# EAGLE design 150218_AriloRX_REV2_0_0 (EAGLE 6.4)
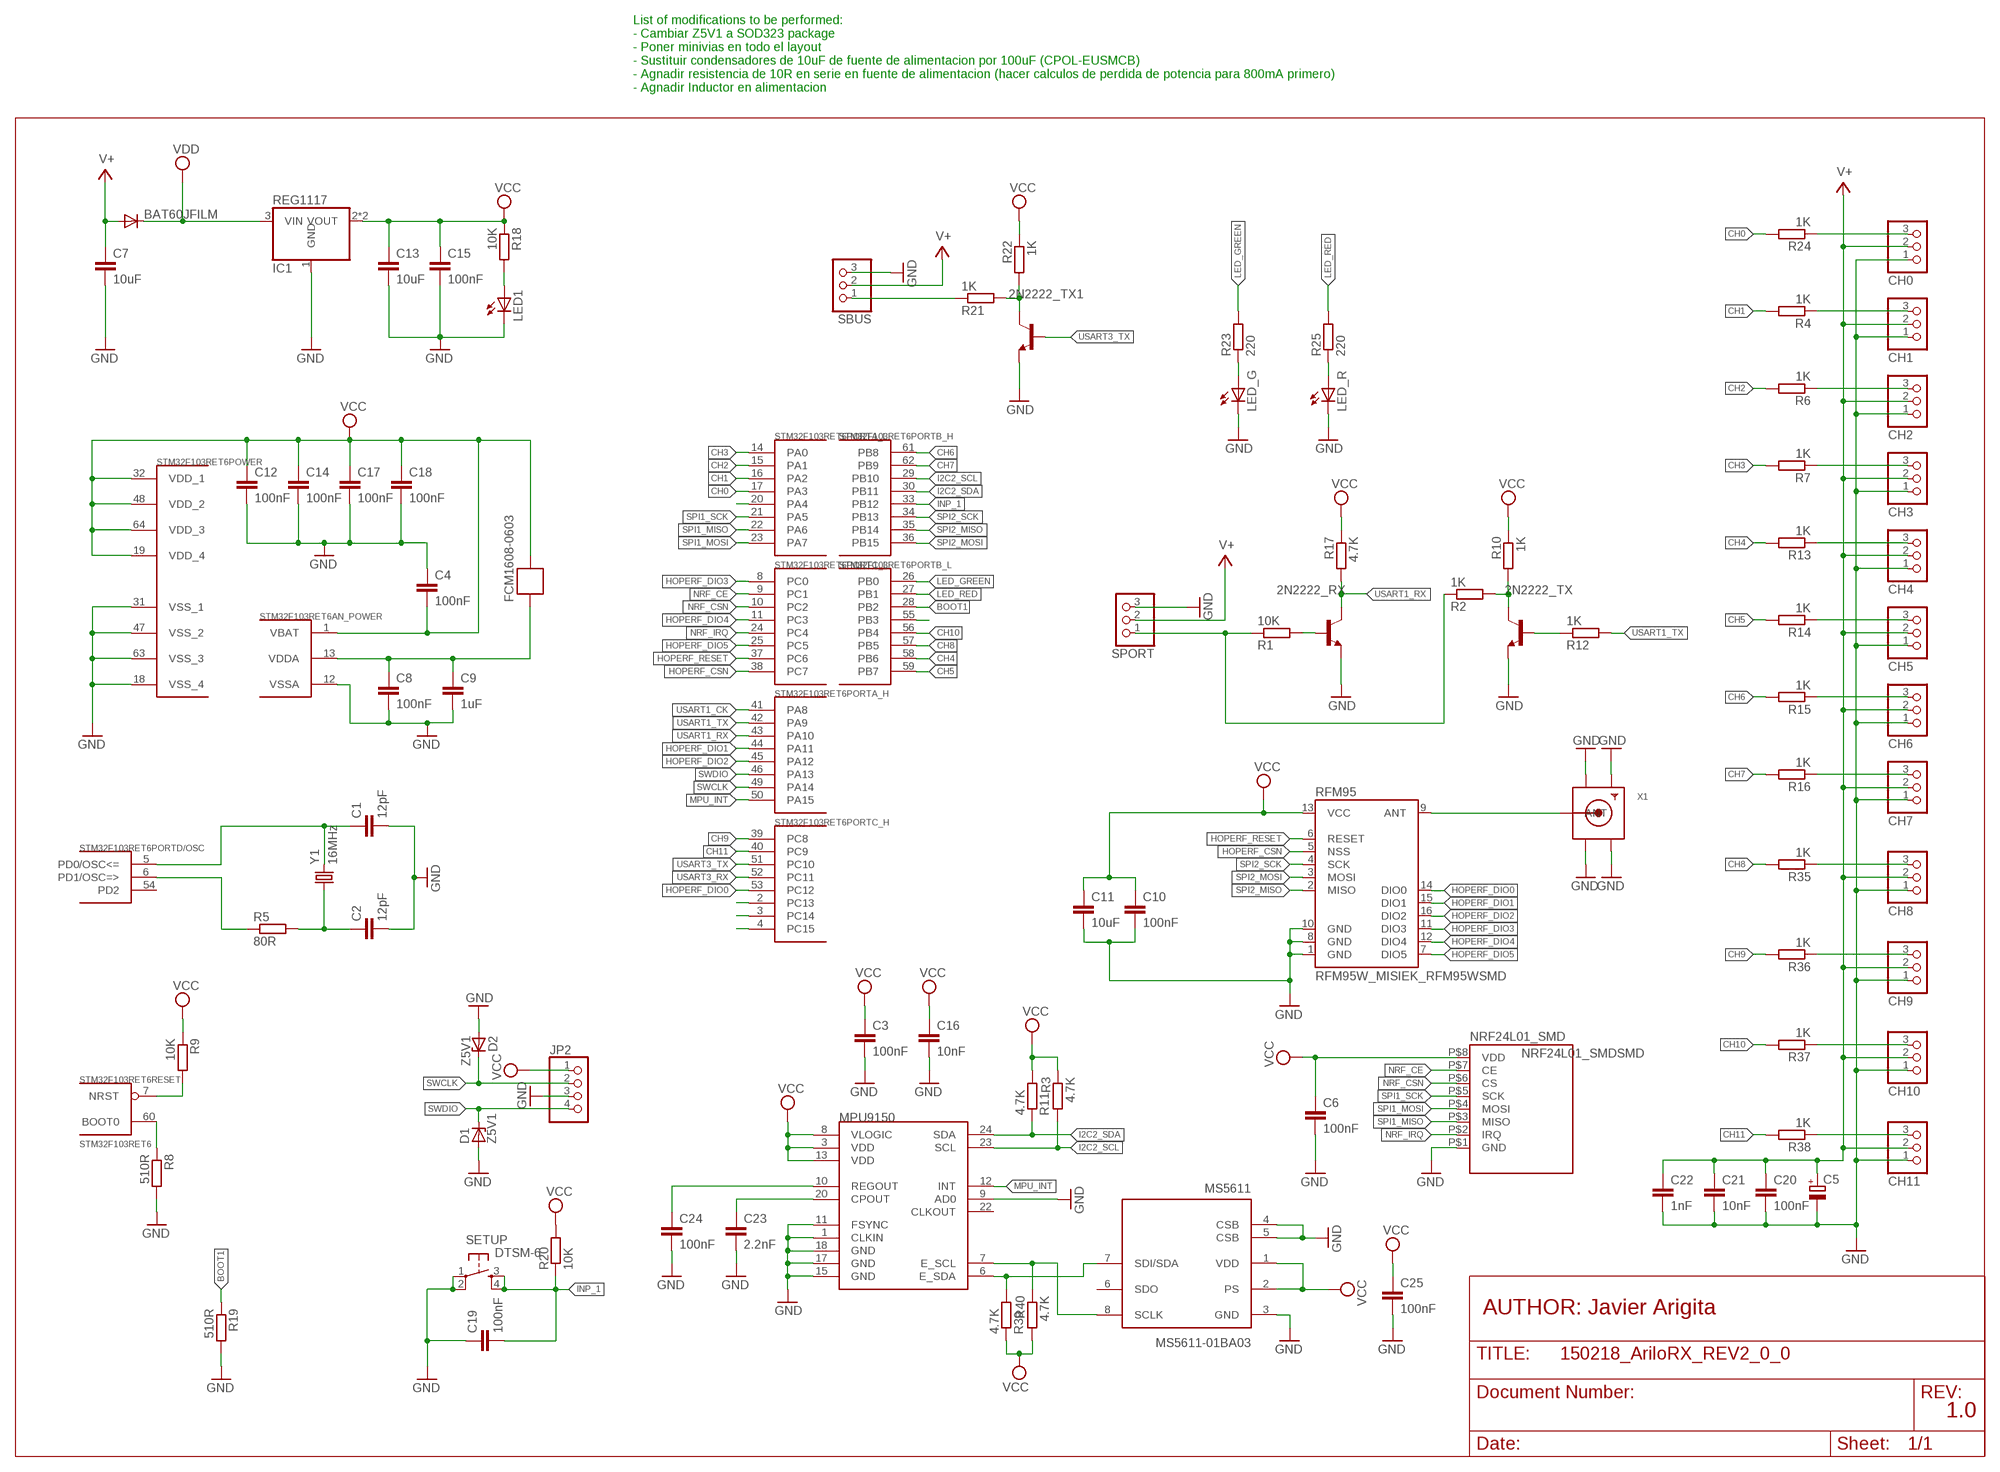
[diagram p0: schematic, sheet 1]

## Parts
2N2222_RX  MMBT2222ALT1-NPN-SOT23-BEC  [SOT23-BEC]
2N2222_TX  MMBT2222ALT1-NPN-SOT23-BEC  [SOT23-BEC]
2N2222_TX1  MMBT2222ALT1-NPN-SOT23-BEC  [SOT23-BEC]
BAT60JFILM  DIODE-SOD323-R  [SOD323-R]
C1  12pF  RESISTOR_C-EUC0603  [RESISTOR_C0603]
C2  12pF  RESISTOR_C-EUC0603  [RESISTOR_C0603]
C3  100nF  RESISTOR_C-EUC0603  [RESISTOR_C0603]
C4  100nF  RESISTOR_C-EUC0603  [RESISTOR_C0603]
C5  CPOL-EUSMCB  [SMC_B]
C6  100nF  RESISTOR_C-EUC0603  [RESISTOR_C0603]
C7  10uF  RESISTOR_C-EUC3216  [RESISTOR_C3216]
C8  100nF  RESISTOR_C-EUC0603  [RESISTOR_C0603]
C9  1uF  RESISTOR_C-EUC0603  [RESISTOR_C0603]
C10  100nF  RESISTOR_C-EUC0603  [RESISTOR_C0603]
C11  10uF  RESISTOR_C-EUC3216  [RESISTOR_C3216]
C12  100nF  RESISTOR_C-EUC0603  [RESISTOR_C0603]
C13  10uF  RESISTOR_C-EUC3216  [RESISTOR_C3216]
C14  100nF  RESISTOR_C-EUC0603  [RESISTOR_C0603]
C15  100nF  RESISTOR_C-EUC0603  [RESISTOR_C0603]
C16  10nF  RESISTOR_C-EUC0603  [RESISTOR_C0603]
C17  100nF  RESISTOR_C-EUC0603  [RESISTOR_C0603]
C18  100nF  RESISTOR_C-EUC0603  [RESISTOR_C0603]
C19  100nF  RESISTOR_C-EUC0603  [RESISTOR_C0603]
C20  100nF  RESISTOR_C-EUC0603  [RESISTOR_C0603]
C21  10nF  RESISTOR_C-EUC0603  [RESISTOR_C0603]
C22  1nF  RESISTOR_C-EUC0603  [RESISTOR_C0603]
C23  2.2nF  RESISTOR_C-EUC0603  [RESISTOR_C0603]
C24  100nF  RESISTOR_C-EUC0603  [RESISTOR_C0603]
C25  100nF  RESISTOR_C-EUC0603  [RESISTOR_C0603]
CH0  PINHD-1X3  [1X03]
CH1  PINHD-1X3  [1X03]
CH2  PINHD-1X3  [1X03]
CH3  PINHD-1X3  [1X03]
CH4  PINHD-1X3  [1X03]
CH5  PINHD-1X3  [1X03]
CH6  PINHD-1X3  [1X03]
CH7  PINHD-1X3  [1X03]
CH8  PINHD-1X3  [1X03]
CH9  PINHD-1X3  [1X03]
CH10  PINHD-1X3  [1X03]
CH11  PINHD-1X3  [1X03]
D1  Z5V1  ZENER-DIODESOD80C  [SOD80C]
D2  Z5V1  ZENER-DIODESOD80C  [SOD80C]
FCM1608-0603  FERRITE-BEAD  [R0603]
IC1  REG1117  [SOT223]
JP2  PINHD-1X4  [1X04]
LED1  LED_LEDCHIP-LED0603  [LED_CHIP-LED0603]
LED_G  LEDCHIP-LED0603  [CHIP-LED0603]
LED_R  LEDCHIP-LED0603  [CHIP-LED0603]
MPU9150  MPU-9150QFN-24-NP  [QFN-24-NP]
MS5611  MS5611-01BA03  [SON125P300X500X100-8N]
NRF24L01_SMD  NRF24L01_SMDSMD  [NRF24L01_SMD]
R1  10K  RCL_R-EU_R0603  [RCL_R0603]
R2  1K  RCL_R-EU_R0603  [RCL_R0603]
R3  4.7K  RCL_R-EU_R0603  [RCL_R0603]
R4  1K  RCL_R-EU_R0603  [RCL_R0603]
R5  80R  RCL_R-EU_R0603  [RCL_R0603]
R6  1K  RCL_R-EU_R0603  [RCL_R0603]
R7  1K  RCL_R-EU_R0603  [RCL_R0603]
R8  510R  RCL_R-EU_R0603  [RCL_R0603]
R9  10K  RCL_R-EU_R0603  [RCL_R0603]
R10  1K  RCL_R-EU_R0603  [RCL_R0603]
R11  4.7K  RCL_R-EU_R0603  [RCL_R0603]
R12  1K  RCL_R-EU_R0603  [RCL_R0603]
R13  1K  RCL_R-EU_R0603  [RCL_R0603]
R14  1K  RCL_R-EU_R0603  [RCL_R0603]
R15  1K  RCL_R-EU_R0603  [RCL_R0603]
R16  1K  RCL_R-EU_R0603  [RCL_R0603]
R17  4.7K  RCL_R-EU_R0603  [RCL_R0603]
R18  10K  RCL_R-EU_R0603  [RCL_R0603]
R19  510R  RCL_R-EU_R0603  [RCL_R0603]
R20  10K  RCL_R-EU_R0603  [RCL_R0603]
R21  1K  RCL_R-EU_R0603  [RCL_R0603]
R22  1K  RCL_R-EU_R0603  [RCL_R0603]
R23  220  RCL_R-EU_R0603  [RCL_R0603]
R24  1K  RCL_R-EU_R0603  [RCL_R0603]
R25  220  RCL_R-EU_R0603  [RCL_R0603]
R35  1K  RCL_R-EU_R0603  [RCL_R0603]
R36  1K  RCL_R-EU_R0603  [RCL_R0603]
R37  1K  RCL_R-EU_R0603  [RCL_R0603]
R38  1K  RCL_R-EU_R0603  [RCL_R0603]
R39  4.7K  RCL_R-EU_R0603  [RCL_R0603]
R40  4.7K  RCL_R-EU_R0603  [RCL_R0603]
RFM95  RFM95W_MISIEK_RFM95WSMD  [RFM95W_MISIEK_RFM95W_SMD]
SBUS  PINHD-1X3  [1X03]
SETUP  DTSM-6  [DTSM-6]
SPORT  PINHD-1X3  [1X03]
STM32F103RET6  STM32F103RET6  STM32F10XRXT6  [TQFP64]
X1  SMACONNECTOR_EDGE  [SMA_EDGELAUNCH]
Y1  16MHz  CRYSTAL5X3  [CRYSTAL-SMD-5X3]

## Nets
BOOT1: R19.1 STM32F103RET6.28(PORTB_L:PB2)
CH0: R24.2 STM32F103RET6.17(PORTA_L:PA3)
CH1: R4.2 STM32F103RET6.16(PORTA_L:PA2)
CH2: R6.2 STM32F103RET6.15(PORTA_L:PA1)
CH3: R7.2 STM32F103RET6.14(PORTA_L:PA0)
CH4: R13.2 STM32F103RET6.58(PORTB_L:PB6)
CH5: R14.2 STM32F103RET6.59(PORTB_L:PB7)
CH6: R15.2 STM32F103RET6.61(PORTB_H:PB8)
CH7: R16.2 STM32F103RET6.62(PORTB_H:PB9)
CH8: R35.2 STM32F103RET6.57(PORTB_L:PB5)
CH9: R36.2 STM32F103RET6.39(PORTC_H:PC8)
CH10: R37.2 STM32F103RET6.56(PORTB_L:PB4)
CH11: R38.2 STM32F103RET6.40(PORTC_H:PC9)
GND: 2N2222_RX.E 2N2222_TX1.E 2N2222_TX.E C1.2 C2.2 C3.2 C4.1 C5.- C6.2 C7.2 C8.2 C9.2 C10.2 C11.2 C12.2 C13.2 C14.2 C15.2 C16.2 C17.2 C18.2 C19.1 C20.2 C21.2 C22.2 C23.2 C24.2 C25.2 CH0.1 CH1.1 CH2.1 CH3.1 CH4.1 CH5.1 CH6.1 CH7.1 CH8.1 CH9.1 CH10.1 CH11.1 D1.A D2.A IC1.1(GND) JP2.3 LED1.C LED_G.C LED_R.C MPU9150.1(CLKIN) MPU9150.9(AD0) MPU9150.11(FSYNC) MPU9150.15(GND) MPU9150.17(GND) MPU9150.18(GND) MS5611.3(GND) MS5611.4(CSB) MS5611.5(CSB) NRF24L01_SMD.P$1(GND) R8.2 R19.2 RFM95.1(GND) RFM95.8(GND) RFM95.10(GND) SBUS.3 SETUP.1 SETUP.2 SPORT.3 STM32F103RET6.12(AN_POWER:VSSA) STM32F103RET6.18(POWER:VSS_4) STM32F103RET6.31(POWER:VSS_1) STM32F103RET6.47(POWER:VSS_2) STM32F103RET6.63(POWER:VSS_3) X1.GND@1(GND4) X1.GND@2(GND3) X1.GND@3(GND2) X1.GND@4(GND1)
HOPERF_CSN: RFM95.5(NSS) STM32F103RET6.38(PORTC_L:PC7)
HOPERF_DIO0: RFM95.14(DIO0) STM32F103RET6.53(PORTC_H:PC12)
HOPERF_DIO1: RFM95.15(DIO1) STM32F103RET6.44(PORTA_H:PA11)
HOPERF_DIO2: RFM95.16(DIO2) STM32F103RET6.45(PORTA_H:PA12)
HOPERF_DIO3: RFM95.11(DIO3) STM32F103RET6.8(PORTC_L:PC0)
HOPERF_DIO4: RFM95.12(DIO4) STM32F103RET6.11(PORTC_L:PC3)
HOPERF_DIO5: RFM95.7(DIO5) STM32F103RET6.25(PORTC_L:PC5)
HOPERF_RESET: RFM95.6(RESET) STM32F103RET6.37(PORTC_L:PC6)
I2C2_SCL: MPU9150.23(SCL) R3.2 STM32F103RET6.29(PORTB_H:PB10)
I2C2_SDA: MPU9150.24(SDA) R11.1 STM32F103RET6.30(PORTB_H:PB11)
INP_1: C19.2 R20.1 SETUP.3 SETUP.4 STM32F103RET6.33(PORTB_H:PB12)
LED_GREEN: R23.2 STM32F103RET6.26(PORTB_L:PB0)
LED_RED: R25.2 STM32F103RET6.27(PORTB_L:PB1)
MPU_INT: MPU9150.12(INT) STM32F103RET6.50(PORTA_H:PA15)
N$1: C1.1 STM32F103RET6.5(PORTD/OSC:PD0/OSC<=) Y1.3
N$2: R5.1 STM32F103RET6.6(PORTD/OSC:PD1/OSC=>)
N$3: C2.1 R5.2 Y1.1
N$4: R8.1 STM32F103RET6.60(RESET:BOOT0)
N$5: 2N2222_TX.C R2.2 R10.2
N$6: STM32F103RET6.20(PORTA_L:PA4)
N$7: RFM95.9(ANT) X1.P(ANT)
N$8: 2N2222_TX.B R12.1
N$9: CH0.3 R24.1
N$10: LED1.A R18.2
N$11: 2N2222_TX1.C R21.2 R22.2
N$12: LED_G.A R23.1
N$13: CH8.3 R35.1
N$14: R1.1 R2.1 SPORT.1
N$15: LED_R.A R25.1
N$16: 2N2222_RX.B R1.2
N$17: C8.1 C9.1 FCM1608-0603.2 STM32F103RET6.13(AN_POWER:VDDA)
N$20: STM32F103RET6.2(PORTC_H:PC13)
N$21: CH2.3 R6.1
N$22: STM32F103RET6.3(PORTC_H:PC14)
N$23: CH4.3 R13.1
N$24: STM32F103RET6.4(PORTC_H:PC15)
N$25: CH9.3 R36.1
N$26: CH10.3 R37.1
N$27: CH11.3 R38.1
N$28: MPU9150.7(E_SCL) MS5611.8(SCLK) R40.1
N$29: MPU9150.6(E_SDA) MS5611.7(SDI/SDA) R39.2
N$30: STM32F103RET6.55(PORTB_L:PB3)
N$31: CH3.3 R7.1
N$32: CH6.3 R15.1
N$33: C23.1 MPU9150.20(CPOUT)
N$34: CH5.3 R14.1
N$35: CH7.3 R16.1
N$40: C24.1 MPU9150.10(REGOUT)
N$53: CH1.3 R4.1
NRF_CE: NRF24L01_SMD.P$7(CE) STM32F103RET6.9(PORTC_L:PC1)
NRF_CSN: NRF24L01_SMD.P$6(CS) STM32F103RET6.10(PORTC_L:PC2)
NRF_IRQ: NRF24L01_SMD.P$2(IRQ) STM32F103RET6.24(PORTC_L:PC4)
NSRST: R9.2 STM32F103RET6.7(RESET:NRST)
SBUS: R21.1 SBUS.1
SPI1_MISO: NRF24L01_SMD.P$3(MISO) STM32F103RET6.22(PORTA_L:PA6)
SPI1_MOSI: NRF24L01_SMD.P$4(MOSI) STM32F103RET6.23(PORTA_L:PA7)
SPI1_SCK: NRF24L01_SMD.P$5(SCK) STM32F103RET6.21(PORTA_L:PA5)
SPI2_MISO: RFM95.2(MISO) STM32F103RET6.35(PORTB_H:PB14)
SPI2_MOSI: RFM95.3(MOSI) STM32F103RET6.36(PORTB_H:PB15)
SPI2_SCK: RFM95.4(SCK) STM32F103RET6.34(PORTB_H:PB13)
SWCLK: D2.C JP2.2 STM32F103RET6.49(PORTA_H:PA14)
SWDIO: D1.C JP2.4 STM32F103RET6.46(PORTA_H:PA13)
USART1_CK: STM32F103RET6.41(PORTA_H:PA8)
USART1_RX: 2N2222_RX.C R17.2 STM32F103RET6.43(PORTA_H:PA10)
USART1_TX: R12.2 STM32F103RET6.42(PORTA_H:PA9)
USART3_RX: STM32F103RET6.52(PORTC_H:PC11)
USART3_TX: 2N2222_TX1.B STM32F103RET6.51(PORTC_H:PC10)
V+: BAT60JFILM.A C5.+ C7.1 C20.1 C21.1 C22.1 CH0.2 CH1.2 CH2.2 CH3.2 CH4.2 CH5.2 CH6.2 CH7.2 CH8.2 CH9.2 CH10.2 CH11.2 SBUS.2 SPORT.2
VCC: C3.1 C4.2 C6.1 C10.1 C11.1 C12.1 C13.1 C14.1 C15.1 C16.1 C17.1 C18.1 C25.1 FCM1608-0603.1 IC1.2(VOUT) IC1.4(VOUT) JP2.1 MPU9150.3(VDD) MPU9150.8(VLOGIC) MPU9150.13(VDD) MS5611.1(VDD) MS5611.2(PS) NRF24L01_SMD.P$8(VDD) R3.1 R9.1 R10.1 R11.2 R17.1 R18.1 R20.2 R22.1 R39.1 R40.2 RFM95.13(VCC) STM32F103RET6.1(AN_POWER:VBAT) STM32F103RET6.19(POWER:VDD_4) STM32F103RET6.32(POWER:VDD_1) STM32F103RET6.48(POWER:VDD_2) STM32F103RET6.64(POWER:VDD_3)
VDD: BAT60JFILM.C IC1.3(VIN)
Unconnected: MPU9150.22(CLKOUT) MS5611.6(SDO) STM32F103RET6.54(PORTD/OSC:PD2)

## Notes on the sheet
- List of modifications to be performed:
  - Cambiar Z5V1 a SOD323 package
  - Poner minivias en todo el layout
  - Sustituir condensadores de 10uF de fuente de alimentacion por 100uF (CPOL-EUSMCB)
  - Agnadir resistencia de 10R en serie en fuente de alimentacion (hacer calculos de perdida de potencia para 800mA primero)
  - Agnadir Inductor en alimentacion
- AUTHOR: Javier Arigita
- 1.0

## Library data of the parts
2N2222_RX 2N2222_TX 2N2222_TX1 = transistor:*-NPN-: NPN Transistror BF959 corrected 2008.03.06
BAT60JFILM = diode:DIODE-: DIODE
C1-C4 C6-C25 = AriloTX:RESISTOR_C-EU: CAPACITOR, European symbol
C5 = rcl:CPOL-EU: POLARIZED CAPACITOR, European symbol
CH0 CH1-CH11 = pinhead_rc:PINHD-1X3: PIN HEADER
D1 D2 = diode:ZENER-DIODE: Z-Diode
FCM1608-0603 = BaseApp:FERRITE-BEAD
IC1 = CEDT:REG1117: 800mA and 1A Low Dropout (LDO) Positive Regulator 1.8V, 2.5V, 2.85V, 3.3V, 5V, and Adj
JP2 = pinhead:PINHD-1X4: PIN HEADER
LED1 = AriloTX:LED_LED: LED OSRAM: - CHIPLED LG R971, LG N971, LY N971, LG Q971, LY Q971, LO R971, LY R971 LH N974, LH R974 LS Q976, LO Q976, LY Q976 LO Q996 - Hyper CHIPLED LW Q18S LB Q993, LB Q99A, LB R99A - SideLED LS A670, LO A670, LY A670, LG A670, LP A670 LB A673, LV A673, LT A673, LW A673 LH A674 LY A675 LS A676, LA A676, LO A676, LY A676, LW A676 LS A679, LY A679, LG A679 - Hyper Micro SIDELED® LS Y876, LA Y876, LO Y876, LY Y876 LT Y87S - SmartLED LW L88C, LW L88S LB L89C, LB L89S, LG L890 LS L89K, LO L89K, LY L89K LS L896, LA L896, LO L896, LY L896 - TOPLED LS T670, LO T670, LY T670, LG T670, LP T670 LSG T670, LSP T670, LSY T670, LOP T670, LYG T670 LG T671, LOG T671, LSG T671 LB T673, LV T673, LT T673, LW T673 LH T674 LS T676, LA T676, LO T676, LY T676, LB T676, LH T676, LSB T676, LW T676 LB T67C, LV T67C, LT T67C, LS T67K, LO T67K, LY T67K, LW E67C LS E67B, LA E67B, LO E67B, LY E67B, LB E67C, LV E67C, LT E67C LW T67C LS T679, LY T679, LG T679 LS T770, LO T770, LY T770, LG T770, LP T770 LB T773, LV T773, LT T773, LW T773 LH T774 LS E675, LA E675, LY E675, LS T675 LS T776, LA T776, LO T776, LY T776, LB T776 LHGB T686 LT T68C, LB T68C - Hyper Mini TOPLED® LB M676 - Mini TOPLED Santana® LG M470 LS M47K, LO M47K, LY M47K Source: http://www.osram.convergy.de LUXEON: - LUMILED® LXK2-PW12-R00, LXK2-PW12-S00, LXK2-PW14-U00, LXK2-PW14-V00 LXK2-PM12-R00, LXK2-PM12-S00, LXK2-PM14-U00 LXK2-PE12-Q00, LXK2-PE12-R00, LXK2-PE12-S00, LXK2-PE14-T00, LXK2-PE14-U00 LXK2-PB12-K00, LXK2-PB12-L00, LXK2-PB12-M00, LXK2-PB14-N00, LXK2-PB14-P00, LXK2-PB14-Q00 LXK2-PR12-L00, LXK2-PR12-M00, LXK2-PR14-Q00, LXK2-PR14-R00 LXK2-PD12-Q00, LXK2-PD12-R00, LXK2-PD12-S00 LXK2-PH12-R00, LXK2-PH12-S00 LXK2-PL12-P00, LXK2-PL12-Q00, LXK2-PL12-R00 Source: www.luxeon.com KINGBRIGHT: KA-3528ASYC Source: www.kingbright.com
LED_G LED_R = led:LED: LED OSRAM: - CHIPLED LG R971, LG N971, LY N971, LG Q971, LY Q971, LO R971, LY R971 LH N974, LH R974 LS Q976, LO Q976, LY Q976 LO Q996 - Hyper CHIPLED LW Q18S LB Q993, LB Q99A, LB R99A - SideLED LS A670, LO A670, LY A670, LG A670, LP A670 LB A673, LV A673, LT A673, LW A673 LH A674 LY A675 LS A676, LA A676, LO A676, LY A676, LW A676 LS A679, LY A679, LG A679 - Hyper Micro SIDELED® LS Y876, LA Y876, LO Y876, LY Y876 LT Y87S - SmartLED LW L88C, LW L88S LB L89C, LB L89S, LG L890 LS L89K, LO L89K, LY L89K LS L896, LA L896, LO L896, LY L896 - TOPLED LS T670, LO T670, LY T670, LG T670, LP T670 LSG T670, LSP T670, LSY T670, LOP T670, LYG T670 LG T671, LOG T671, LSG T671 LB T673, LV T673, LT T673, LW T673 LH T674 LS T676, LA T676, LO T676, LY T676, LB T676, LH T676, LSB T676, LW T676 LB T67C, LV T67C, LT T67C, LS T67K, LO T67K, LY T67K, LW E67C LS E67B, LA E67B, LO E67B, LY E67B, LB E67C, LV E67C, LT E67C LW T67C LS T679, LY T679, LG T679 LS T770, LO T770, LY T770, LG T770, LP T770 LB T773, LV T773, LT T773, LW T773 LH T774 LS E675, LA E675, LY E675, LS T675 LS T776, LA T776, LO T776, LY T776, LB T776 LHGB T686 LT T68C, LB T68C - Hyper Mini TOPLED® LB M676 - Mini TOPLED Santana® LG M470 LS M47K, LO M47K, LY M47K Source: http://www.osram.convergy.de LUXEON: - LUMILED® LXK2-PW12-R00, LXK2-PW12-S00, LXK2-PW14-U00, LXK2-PW14-V00 LXK2-PM12-R00, LXK2-PM12-S00, LXK2-PM14-U00 LXK2-PE12-Q00, LXK2-PE12-R00, LXK2-PE12-S00, LXK2-PE14-T00, LXK2-PE14-U00 LXK2-PB12-K00, LXK2-PB12-L00, LXK2-PB12-M00, LXK2-PB14-N00, LXK2-PB14-P00, LXK2-PB14-Q00 LXK2-PR12-L00, LXK2-PR12-M00, LXK2-PR14-Q00, LXK2-PR14-R00 LXK2-PD12-Q00, LXK2-PD12-R00, LXK2-PD12-S00 LXK2-PH12-R00, LXK2-PH12-S00 LXK2-PL12-P00, LXK2-PL12-Q00, LXK2-PL12-R00 Source: www.luxeon.com KINGBRIGHT: KA-3528ASYC Source: www.kingbright.com
MPU9150 = SparkFun-Sensors:MPU-9150: 9DOF (3mag, 3accel, 3rotat). I2C interface.
MS5611 = Measurement-Specialties:MS5611-01BA03: Variometer Module, with stainless steel cap
NRF24L01_SMD = NRF24L01+:NRF24L01_SMD
R1-R25 R35-R40 = AriloTX:RCL_R-EU_: RESISTOR, European symbol
RFM95 = AriloTX:RFM95W_MISIEK_RFM95W
SBUS SPORT = pinhead:PINHD-1X3: PIN HEADER
SETUP = switch-tact:DTSM-6
STM32F103RET6 = stm32:STM32F10XRXT6: STM32F101/103 64pin LQFP
X1 = adafruit:SMACONNECTOR: SMA Connector 90° DIP SMA Connector, 50 Ohm (4UConnector: 07259)
Y1 = SparkFun-FreqCtrl:CRYSTAL: Various standard crystals. Proven footprints. Spark Fun Electronics SKU : COM-00534

## Board
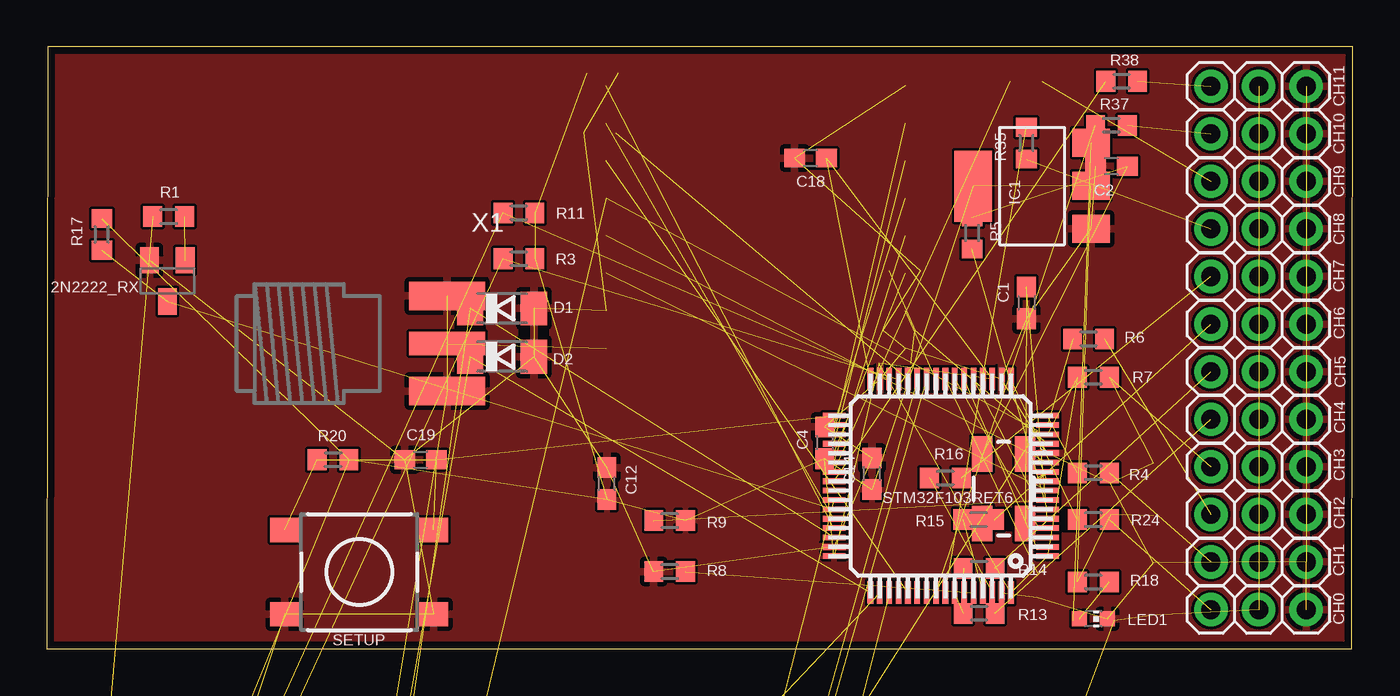
[diagram p1: board, top side]
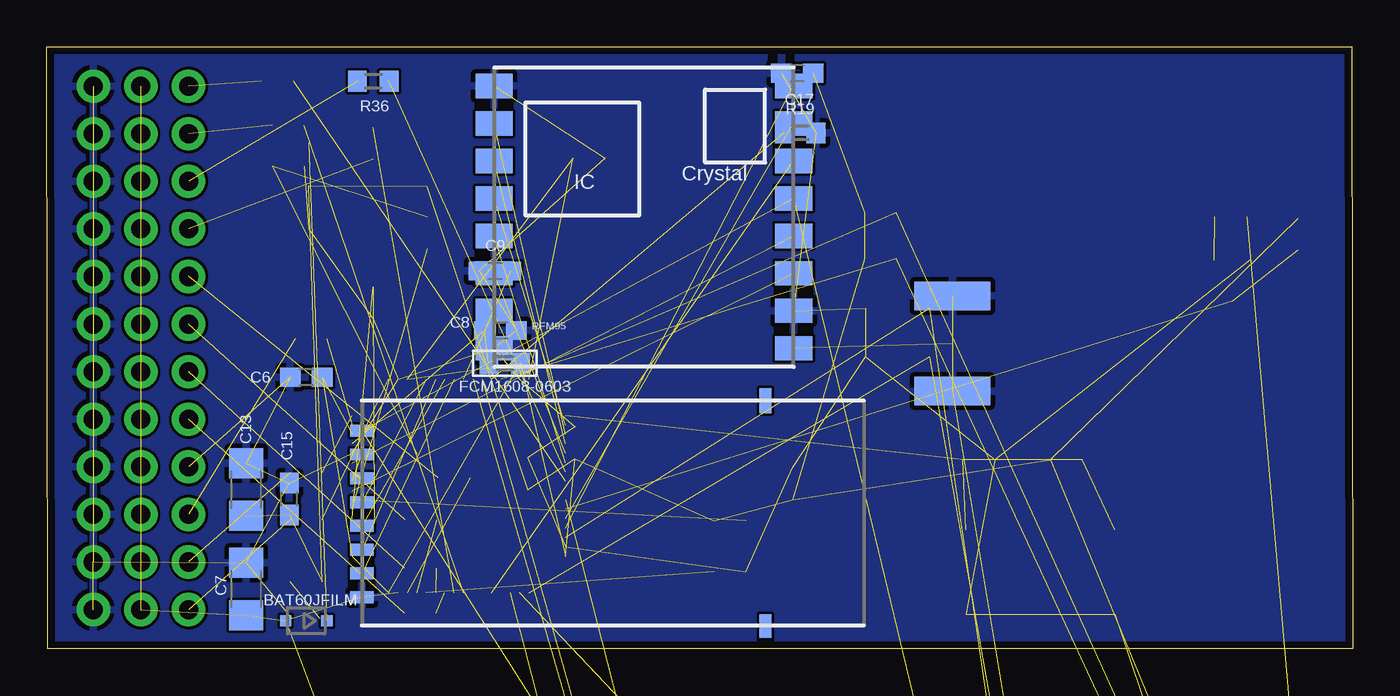
[diagram p2: board, bottom side, seen from below]

Size 69.73 x 32.14 mm. Coordinates in mm from the lower left corner, seen from the top.
Outline: 0,0 69.69,0 69.73,32.14 0.05,32.14 0,0
Copper layers (1*16): Top 0.0356mm / dielectric 1.5011mm / Bottom 0.0356mm
Design rules "default": minimum track width 6mil, minimum drill 13mil, track to track 6mil, track to pad 6mil, pad to pad 6mil, via to via 6mil, smd to smd 6mil, copper to edge 15mil, drill to drill 6mil, minimum pad ring 7mil, minimum via ring 7mil, stop-mask expansion 4mil, vias tented up to drill 0mil, thermal gap 10mil

### Footprints (pad centres in the part's own frame; a part is rotated, then mirrored left to right if it is on the bottom)
SOT23-BEC = smd 1 x 1.4: B -0.95,-1.1; C 0,1.1; E 0.95,-1.1
SOD323-R = smd 0.6 x 0.6: A 1.1,0; C -1.1,0
RESISTOR_C0603 = smd 1.1 x 1: 1 -0.85,0; 2 0.85,0
SMC_B = smd 1.6 x 2.4: + -1.5,0; - 1.5,0
RESISTOR_C3216 = smd 1.6 x 1.8: 1 -1.4,0; 2 1.4,0
1X03 = drill 1.016 pad 1.778: 1 -2.54,0; 2 0,0; 3 2.54,0
SOD80C = smd 1.4 x 1.8: A 1.7,0; C -1.7,0
R0603 = smd 1 x 1.1: 1 -0.85,0; 2 0.85,0
SOT223 = smd 1.499 x 2.007: 1 -2.261,-3.15; 2 0.025,-3.15; 3 2.311,-3.15 | smd 3.81 x 2.007: 4 0,3.15
1X04 = drill 1.016 long: 1 -3.81,0; 2 -1.27,0; 3 1.27,0; 4 3.81,0
LED_CHIP-LED0603 = smd 0.8 x 0.8: A 0,-0.75; C 0,0.75
CHIP-LED0603 = smd 0.8 x 0.8: A 0,-0.75; C 0,0.75
QFN-24-NP = smd 0.8 x 0.3: 1 -2,1.25; 2 -2,0.75; 3 -2,0.25; 4 -2,-0.25; 5 -2,-0.75; 6 -2,-1.25; 13 2,-1.25; 14 2,-0.75; 15 2,-0.25; 16 2,0.25; 17 2,0.75; 18 2,1.25 | smd 0.3 x 0.8: 7 -1.25,-2; 8 -0.75,-2; 9 -0.25,-2; 10 0.25,-2; 11 0.75,-2; 12 1.25,-2; 19 1.25,2; 20 0.75,2; 21 0.25,2; 22 -0.25,2; 23 -0.75,2; 24 -1.25,2
SON125P300X500X100-8N = smd 1.35 x 0.55: 1 -1.2,1.875; 2 -1.2,0.625; 3 -1.2,-0.625; 4 -1.2,-1.875; 5 1.2,-1.875; 6 1.2,-0.625; 7 1.2,0.625; 8 1.2,1.875
NRF24L01_SMD = smd 1.27 x 0.635: P$1 26.807,10.492; P$2 26.807,9.222; P$3 26.807,7.952; P$4 26.807,6.682; P$5 26.807,5.412; P$6 26.807,4.142; P$7 26.807,2.872; P$8 26.807,1.602 | smd 0.635 x 1.27: P$9 5.267,0.032; P$11 5.267,-0.018; P$13 5.267,12.032
RCL_R0603 = smd 1 x 1.1: 1 -0.85,0; 2 0.85,0
RFM95W_MISIEK_RFM95W_SMD = smd 2 x 1.3: 1 -8,7; 2 -8,5; 3 -8,3; 4 -8,1; 5 -8,-1; 6 -8,-3; 7 -8,-5; 8 -8,-7; 9 8,-7; 10 8,-5; 11 8,-3; 12 8,-1; 13 8,1; 14 8,3; 15 8,5; 16 8,7
1X03' = drill 1.016 long: 1 -2.54,0; 2 0,0; 3 2.54,0
DTSM-6 = smd 1.55 x 1.3: 1 -3.975,2.25; 2 3.975,2.25; 3 -3.975,-2.25; 4 3.975,-2.25
TQFP64 = smd 1.2 x 0.3: 1 -5.7,3.75; 2 -5.7,3.25; 3 -5.7,2.75; 4 -5.7,2.25; 5 -5.7,1.75; 6 -5.7,1.25; 7 -5.7,0.75; 8 -5.7,0.25; 9 -5.7,-0.25; 10 -5.7,-0.75; 11 -5.7,-1.25; 12 -5.7,-1.75; 13 -5.7,-2.25; 14 -5.7,-2.75; 15 -5.7,-3.25; 16 -5.7,-3.75; 33 5.7,-3.75; 34 5.7,-3.25; 35 5.7,-2.75; 36 5.7,-2.25; 37 5.7,-1.75; 38 5.7,-1.25; 39 5.7,-0.75; 40 5.7,-0.25; 41 5.7,0.25; 42 5.7,0.75; 43 5.7,1.25; 44 5.7,1.75; 45 5.7,2.25; 46 5.7,2.75; 47 5.7,3.25; 48 5.7,3.75 | smd 0.3 x 1.2: 17 -3.75,-5.7; 18 -3.25,-5.7; 19 -2.75,-5.7; 20 -2.25,-5.7; 21 -1.75,-5.7; 22 -1.25,-5.7; 23 -0.75,-5.7; 24 -0.25,-5.7; 25 0.25,-5.7; 26 0.75,-5.7; 27 1.25,-5.7; 28 1.75,-5.7; 29 2.25,-5.7; 30 2.75,-5.7; 31 3.25,-5.7; 32 3.75,-5.7; 49 3.75,5.7; 50 3.25,5.7; 51 2.75,5.7; 52 2.25,5.7; 53 1.75,5.7; 54 1.25,5.7; 55 0.75,5.7; 56 0.25,5.7; 57 -0.25,5.7; 58 -0.75,5.7; 59 -1.25,5.7; 60 -1.75,5.7; 61 -2.25,5.7; 62 -2.75,5.7; 63 -3.25,5.7; 64 -3.75,5.7
SMA_EDGELAUNCH = smd 4.064 x 1.524: GND@1 2.032,-2.54; GND@2 2.032,2.54 | smd 4.064 x 1.524 bottom: GND@3 2.032,2.54; GND@4 2.032,-2.54 | smd 4.064 x 1.27: P 2.032,0
CRYSTAL-SMD-5X3 = smd 1.9 x 1.1: 1 -1.85,-1.15; 2 1.85,-1.15; 3 1.85,1.15; 4 -1.85,1.15

### Placement (x,y rotation side)
2N2222_RX  6.43,19.65 180 top
2N2222_TX  -11.05,-186.6 0 top  (outside the outline)
2N2222_TX1  -11.05,-215.85 0 top  (outside the outline)
BAT60JFILM  55.88,1.5 180 bottom
C1  52.31,18.48 270 top
C2  56.85,25.76 180 top
C3  -5.8,-53.55 0 top  (outside the outline)
C4  41.53,11 270 top
C5  -20.55,-229.15 0 top  (outside the outline)
C6  55.88,14.5 180 bottom
C7  59.09,3.2 90 bottom
C8  45.51,17 0 bottom
C9  45.81,20.18 180 bottom
C10  -11.45,-151.35 0 top  (outside the outline)
C11  -10.95,-157.25 0 top  (outside the outline)
C12  29.91,8.82 90 top
C13  59.09,8.5 90 bottom
C14  44.06,9.35 90 top
C15  56.78,8 90 bottom
C16  -5.8,-59.6 0 top  (outside the outline)
C17  29.66,30.73 180 bottom
C18  40.78,26.2 180 top
C19  19.96,10.1 0 top
C20  -21.45,-233.05 0 top  (outside the outline)
C21  -21.45,-238.05 0 top  (outside the outline)
C22  -21.45,-243.05 0 top  (outside the outline)
C23  -10.6,-77.75 0 top  (outside the outline)
C24  -10.6,-83.8 0 top  (outside the outline)
C25  -10.6,-89.85 0 top  (outside the outline)
CH0  64.71,2.1 180 top
CH1  64.71,4.64 180 top
CH2  64.71,7.18 180 top
CH3  64.71,9.72 180 top
CH4  64.71,12.26 180 top
CH5  64.71,14.8 180 top
CH6  64.71,17.34 180 top
CH7  64.71,19.88 180 top
CH8  64.71,22.42 180 top
CH9  64.71,24.96 180 top
CH10  64.71,27.5 180 top
CH11  64.71,30.04 180 top
D1  24.31,18.18 0 top
D2  24.31,15.6 0 top
FCM1608-0603  45.28,15.25 180 bottom
IC1  52.62,24.7 90 top
JP2  -7.8,-163.7 0 top  (outside the outline)
LED1  55.88,1.6 270 top
LED_G  -15.9,-216.5 0 top  (outside the outline)
LED_R  -20.65,-216.5 0 top  (outside the outline)
MPU9150  -4.85,-45.9 0 top  (outside the outline)
MS5611  -10,-59.85 0 top  (outside the outline)
NRF24L01_SMD  26.1,13.25 180 bottom
R1  6.51,23.07 0 top
R2  -11.45,-179.95 0 top  (outside the outline)
R3  25.21,20.82 180 top
R4  55.88,9.4 180 top
R5  49.41,22.2 90 top
R6  55.63,16.55 180 top
R7  55.88,14.5 180 top
R8  33.26,4.12 180 top
R9  33.26,6.85 180 top
R10  -11.45,-191.5 0 top  (outside the outline)
R11  25.21,23.27 0 top
R12  -11.45,-197.55 0 top  (outside the outline)
R13  49.78,1.9 180 top
R14  49.78,4.3 180 top
R15  49.76,6.9 180 top
R16  47.98,9.12 180 top
R17  2.94,22.12 270 top
R18  55.88,3.58 0 top
R19  29.51,27.55 0 bottom
R20  15.29,10.1 0 top
R21  -11.45,-209.2 0 top  (outside the outline)
R22  -6.3,-209.2 0 top  (outside the outline)
R23  -21.45,-220.1 0 top  (outside the outline)
R24  55.88,6.9 180 top
R25  -21.45,-223.45 0 top  (outside the outline)
R35  52.31,27 90 top
R36  52.3,30.3 0 bottom
R37  56.85,27.95 180 top
R38  57.4,30.3 180 top
R39  -10.6,-65.65 0 top  (outside the outline)
R40  -10.6,-71.7 0 top  (outside the outline)
RFM95  37.85,23.05 0 bottom
SBUS  [1X03']  -9.05,-204.15 0 top  (outside the outline)
SETUP  16.68,4.1 180 top
SPORT  [1X03']  -9.05,-174.9 0 top  (outside the outline)
STM32F103RET6  47.73,8.7 180 top
X1  19.35,16.3 0 top
Y1  51.1,8.55 270 top

### Tracks (layer width: path | path; a pad name or v marks a point on that pad's centre or on a via)
BOOT1  (1 unrouted)
CH0  (1 unrouted)
CH1  (1 unrouted)
CH2  (1 unrouted)
CH3  (1 unrouted)
CH4  (1 unrouted)
CH5  (1 unrouted)
CH6  (1 unrouted)
CH7  (1 unrouted)
CH8  (1 unrouted)
CH9  (1 unrouted)
CH10  (1 unrouted)
CH11  (1 unrouted)
GND  (74 unrouted)
  pour Bottom (rank 2): 0.48,31.64 69.19,31.64 69.19,0.5 0.48,0.5
  pour Top: 0.48,31.64 69.19,31.64 69.19,0.5 0.48,0.5
HOPERF_CSN  (1 unrouted)
HOPERF_DIO0  (1 unrouted)
HOPERF_DIO1  (1 unrouted)
HOPERF_DIO2  (1 unrouted)
HOPERF_DIO3  (1 unrouted)
HOPERF_DIO4  (1 unrouted)
HOPERF_DIO5  (1 unrouted)
HOPERF_RESET  (1 unrouted)
I2C2_SCL  (2 unrouted)
I2C2_SDA  (2 unrouted)
INP_1  (4 unrouted)
LED_GREEN  (1 unrouted)
LED_RED  (1 unrouted)
MPU_INT  (1 unrouted)
N$1  (2 unrouted)
N$2  (1 unrouted)
N$3  (2 unrouted)
N$4  (1 unrouted)
N$5  (2 unrouted)
N$7  (1 unrouted)
N$8  (1 unrouted)
N$9  (1 unrouted)
N$10  (1 unrouted)
N$11  (2 unrouted)
N$12  (1 unrouted)
N$13  (1 unrouted)
N$14  (2 unrouted)
N$15  (1 unrouted)
N$16  (1 unrouted)
N$17  (3 unrouted)
N$21  (1 unrouted)
N$23  (1 unrouted)
N$25  (1 unrouted)
N$26  (1 unrouted)
N$27  (1 unrouted)
N$28  (2 unrouted)
N$29  (2 unrouted)
N$31  (1 unrouted)
N$32  (1 unrouted)
N$33  (1 unrouted)
N$34  (1 unrouted)
N$35  (1 unrouted)
N$40  (1 unrouted)
N$53  (1 unrouted)
NRF_CE  (1 unrouted)
NRF_CSN  (1 unrouted)
NRF_IRQ  (1 unrouted)
NSRST  (1 unrouted)
SBUS  (1 unrouted)
SPI1_MISO  (1 unrouted)
SPI1_MOSI  (1 unrouted)
SPI1_SCK  (1 unrouted)
SPI2_MISO  (1 unrouted)
SPI2_MOSI  (1 unrouted)
SPI2_SCK  (1 unrouted)
SWCLK  (2 unrouted)
SWDIO  (2 unrouted)
USART1_RX  (2 unrouted)
USART1_TX  (1 unrouted)
USART3_TX  (1 unrouted)
V+  (19 unrouted)
VCC  (38 unrouted)
  pour Top (isolate 0.305): 29.11,9.57 29.11,0.53 50.19,0.53 50.19,9.57
VDD  (1 unrouted)

### Text on the board
bPlace: AriloRX | (c) J.ARIGITA